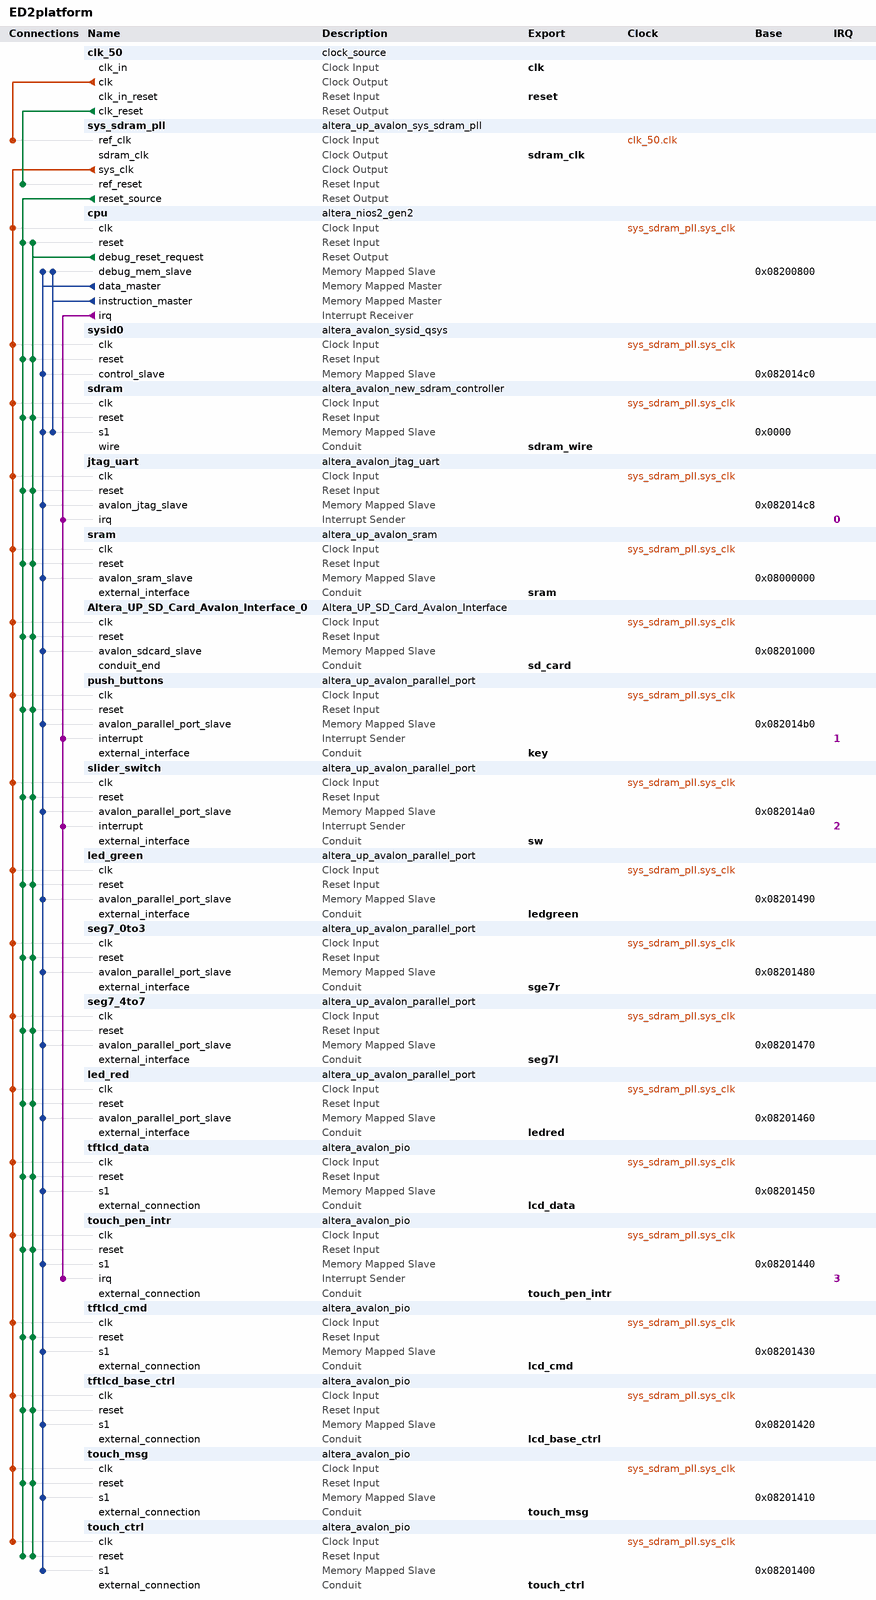
[diagram p0: system contents]
# Platform Designer (Qsys) system ED2platform, Cyclone IV E EP4CE115F29C7
# Parameters at their usual value, and those the tool derives, are not listed.
package require -exact qsys 15.0
create_system ED2platform
set_project_property DEVICE_FAMILY {Cyclone IV E}
set_project_property DEVICE EP4CE115F29C7

add_instance clk_50 clock_source 15.0
set_instance_parameter_value clk_50 clockFrequency 50000000

add_instance sys_sdram_pll altera_up_avalon_sys_sdram_pll 15.0
set_instance_parameter_value sys_sdram_pll CV_boards DE1-SoC
set_instance_parameter_value sys_sdram_pll gui_outclk 50.0
set_instance_parameter_value sys_sdram_pll gui_refclk 50.0

add_instance cpu altera_nios2_gen2 15.0
set_instance_parameter_value cpu dcache_size 2048
set_instance_parameter_value cpu exceptionSlave sdram.s1
set_instance_parameter_value cpu icache_size 4096
set_instance_parameter_value cpu impl Fast
set_instance_parameter_value cpu resetSlave sdram.s1
set_instance_parameter_value cpu setting_activateTrace true

add_instance sysid0 altera_avalon_sysid_qsys 15.0
set_instance_parameter_value sysid0 id 305419896

add_instance sdram altera_avalon_new_sdram_controller 15.0
set_instance_parameter_value sdram TAC 5.5
set_instance_parameter_value sdram TRCD 20.0
set_instance_parameter_value sdram TRP 20.0
set_instance_parameter_value sdram casLatency 3
set_instance_parameter_value sdram columnWidth 10
set_instance_parameter_value sdram dataWidth 32
set_instance_parameter_value sdram generateSimulationModel true
set_instance_parameter_value sdram model single_Micron_MT48LC4M32B2_7_chip
set_instance_parameter_value sdram numberOfBanks 4
set_instance_parameter_value sdram numberOfChipSelects 1
set_instance_parameter_value sdram powerUpDelay 100.0
set_instance_parameter_value sdram refreshPeriod 15.625
set_instance_parameter_value sdram rowWidth 13

add_instance jtag_uart altera_avalon_jtag_uart 15.0
set_instance_parameter_value jtag_uart simInteractiveOptions NO_INTERACTIVE_WINDOWS

add_instance sram altera_up_avalon_sram 15.0
set_instance_parameter_value sram board DE2-115
set_instance_parameter_value sram pixel_buffer false

add_instance Altera_UP_SD_Card_Avalon_Interface_0 Altera_UP_SD_Card_Avalon_Interface 15.0

add_instance push_buttons altera_up_avalon_parallel_port 15.0
set_instance_parameter_value push_buttons board DE2-115
set_instance_parameter_value push_buttons capture true
set_instance_parameter_value push_buttons edge Either
set_instance_parameter_value push_buttons irq true
set_instance_parameter_value push_buttons preset Pushbuttons

add_instance slider_switch altera_up_avalon_parallel_port 15.0
set_instance_parameter_value slider_switch board DE2-115
set_instance_parameter_value slider_switch capture true
set_instance_parameter_value slider_switch edge Either
set_instance_parameter_value slider_switch irq true
set_instance_parameter_value slider_switch preset {Slider Switches}

add_instance led_green altera_up_avalon_parallel_port 15.0
set_instance_parameter_value led_green board DE2-115
set_instance_parameter_value led_green capture false
set_instance_parameter_value led_green edge Rising
set_instance_parameter_value led_green irq false
set_instance_parameter_value led_green preset LEDs

add_instance seg7_0to3 altera_up_avalon_parallel_port 15.0
set_instance_parameter_value seg7_0to3 board DE2-115
set_instance_parameter_value seg7_0to3 capture false
set_instance_parameter_value seg7_0to3 edge Rising
set_instance_parameter_value seg7_0to3 irq false
set_instance_parameter_value seg7_0to3 preset {Seven Segment Displays}

add_instance seg7_4to7 altera_up_avalon_parallel_port 15.0
set_instance_parameter_value seg7_4to7 board DE2-115
set_instance_parameter_value seg7_4to7 capture false
set_instance_parameter_value seg7_4to7 edge Rising
set_instance_parameter_value seg7_4to7 irq false
set_instance_parameter_value seg7_4to7 preset {Seven Segment Displays}
set_instance_parameter_value seg7_4to7 sevensegs {7 to 4}

add_instance led_red altera_up_avalon_parallel_port 15.0
set_instance_parameter_value led_red board DE2-115
set_instance_parameter_value led_red capture false
set_instance_parameter_value led_red edge Rising
set_instance_parameter_value led_red irq false
set_instance_parameter_value led_red leds Red
set_instance_parameter_value led_red preset LEDs

add_instance tftlcd_data altera_avalon_pio 15.0
set_instance_parameter_value tftlcd_data direction Bidir
set_instance_parameter_value tftlcd_data width 16

add_instance touch_pen_intr altera_avalon_pio 15.0
set_instance_parameter_value touch_pen_intr captureEdge true
set_instance_parameter_value touch_pen_intr direction Input
set_instance_parameter_value touch_pen_intr edgeType ANY
set_instance_parameter_value touch_pen_intr generateIRQ true
set_instance_parameter_value touch_pen_intr width 1

add_instance tftlcd_cmd altera_avalon_pio 15.0
set_instance_parameter_value tftlcd_cmd direction Output
set_instance_parameter_value tftlcd_cmd width 3

add_instance tftlcd_base_ctrl altera_avalon_pio 15.0
set_instance_parameter_value tftlcd_base_ctrl direction Output
set_instance_parameter_value tftlcd_base_ctrl width 3

add_instance touch_msg altera_avalon_pio 15.0
set_instance_parameter_value touch_msg direction Input
set_instance_parameter_value touch_msg width 2

add_instance touch_ctrl altera_avalon_pio 15.0
set_instance_parameter_value touch_ctrl direction Output
set_instance_parameter_value touch_ctrl width 3

# connections
add_connection clk_50.clk sys_sdram_pll.ref_clk clock
add_connection sys_sdram_pll.sys_clk Altera_UP_SD_Card_Avalon_Interface_0.clk clock
add_connection sys_sdram_pll.sys_clk cpu.clk clock
add_connection sys_sdram_pll.sys_clk jtag_uart.clk clock
add_connection sys_sdram_pll.sys_clk led_green.clk clock
add_connection sys_sdram_pll.sys_clk led_red.clk clock
add_connection sys_sdram_pll.sys_clk push_buttons.clk clock
add_connection sys_sdram_pll.sys_clk sdram.clk clock
add_connection sys_sdram_pll.sys_clk seg7_0to3.clk clock
add_connection sys_sdram_pll.sys_clk seg7_4to7.clk clock
add_connection sys_sdram_pll.sys_clk slider_switch.clk clock
add_connection sys_sdram_pll.sys_clk sram.clk clock
add_connection sys_sdram_pll.sys_clk sysid0.clk clock
add_connection sys_sdram_pll.sys_clk tftlcd_base_ctrl.clk clock
add_connection sys_sdram_pll.sys_clk tftlcd_cmd.clk clock
add_connection sys_sdram_pll.sys_clk tftlcd_data.clk clock
add_connection sys_sdram_pll.sys_clk touch_ctrl.clk clock
add_connection sys_sdram_pll.sys_clk touch_msg.clk clock
add_connection sys_sdram_pll.sys_clk touch_pen_intr.clk clock
add_connection clk_50.clk_reset sys_sdram_pll.ref_reset reset
add_connection cpu.debug_reset_request Altera_UP_SD_Card_Avalon_Interface_0.reset reset
add_connection cpu.debug_reset_request cpu.reset reset
add_connection cpu.debug_reset_request jtag_uart.reset reset
add_connection cpu.debug_reset_request led_green.reset reset
add_connection cpu.debug_reset_request led_red.reset reset
add_connection cpu.debug_reset_request push_buttons.reset reset
add_connection cpu.debug_reset_request sdram.reset reset
add_connection cpu.debug_reset_request seg7_0to3.reset reset
add_connection cpu.debug_reset_request seg7_4to7.reset reset
add_connection cpu.debug_reset_request slider_switch.reset reset
add_connection cpu.debug_reset_request sram.reset reset
add_connection cpu.debug_reset_request sysid0.reset reset
add_connection cpu.debug_reset_request tftlcd_base_ctrl.reset reset
add_connection cpu.debug_reset_request tftlcd_cmd.reset reset
add_connection cpu.debug_reset_request tftlcd_data.reset reset
add_connection cpu.debug_reset_request touch_ctrl.reset reset
add_connection cpu.debug_reset_request touch_msg.reset reset
add_connection cpu.debug_reset_request touch_pen_intr.reset reset
add_connection sys_sdram_pll.reset_source Altera_UP_SD_Card_Avalon_Interface_0.reset reset
add_connection sys_sdram_pll.reset_source cpu.reset reset
add_connection sys_sdram_pll.reset_source jtag_uart.reset reset
add_connection sys_sdram_pll.reset_source led_green.reset reset
add_connection sys_sdram_pll.reset_source led_red.reset reset
add_connection sys_sdram_pll.reset_source push_buttons.reset reset
add_connection sys_sdram_pll.reset_source sdram.reset reset
add_connection sys_sdram_pll.reset_source seg7_0to3.reset reset
add_connection sys_sdram_pll.reset_source seg7_4to7.reset reset
add_connection sys_sdram_pll.reset_source slider_switch.reset reset
add_connection sys_sdram_pll.reset_source sram.reset reset
add_connection sys_sdram_pll.reset_source sysid0.reset reset
add_connection sys_sdram_pll.reset_source tftlcd_base_ctrl.reset reset
add_connection sys_sdram_pll.reset_source tftlcd_cmd.reset reset
add_connection sys_sdram_pll.reset_source tftlcd_data.reset reset
add_connection sys_sdram_pll.reset_source touch_ctrl.reset reset
add_connection sys_sdram_pll.reset_source touch_msg.reset reset
add_connection sys_sdram_pll.reset_source touch_pen_intr.reset reset
add_connection cpu.data_master Altera_UP_SD_Card_Avalon_Interface_0.avalon_sdcard_slave avalon
set_connection_parameter_value cpu.data_master/Altera_UP_SD_Card_Avalon_Interface_0.avalon_sdcard_slave baseAddress 0x08201000
add_connection cpu.data_master cpu.debug_mem_slave avalon
set_connection_parameter_value cpu.data_master/cpu.debug_mem_slave baseAddress 0x08200800
add_connection cpu.data_master jtag_uart.avalon_jtag_slave avalon
set_connection_parameter_value cpu.data_master/jtag_uart.avalon_jtag_slave baseAddress 0x082014c8
add_connection cpu.data_master led_green.avalon_parallel_port_slave avalon
set_connection_parameter_value cpu.data_master/led_green.avalon_parallel_port_slave baseAddress 0x08201490
add_connection cpu.data_master led_red.avalon_parallel_port_slave avalon
set_connection_parameter_value cpu.data_master/led_red.avalon_parallel_port_slave baseAddress 0x08201460
add_connection cpu.data_master push_buttons.avalon_parallel_port_slave avalon
set_connection_parameter_value cpu.data_master/push_buttons.avalon_parallel_port_slave baseAddress 0x082014b0
add_connection cpu.data_master sdram.s1 avalon
set_connection_parameter_value cpu.data_master/sdram.s1 baseAddress 0x0000
add_connection cpu.data_master seg7_0to3.avalon_parallel_port_slave avalon
set_connection_parameter_value cpu.data_master/seg7_0to3.avalon_parallel_port_slave baseAddress 0x08201480
add_connection cpu.data_master seg7_4to7.avalon_parallel_port_slave avalon
set_connection_parameter_value cpu.data_master/seg7_4to7.avalon_parallel_port_slave baseAddress 0x08201470
add_connection cpu.data_master slider_switch.avalon_parallel_port_slave avalon
set_connection_parameter_value cpu.data_master/slider_switch.avalon_parallel_port_slave baseAddress 0x082014a0
add_connection cpu.data_master sram.avalon_sram_slave avalon
set_connection_parameter_value cpu.data_master/sram.avalon_sram_slave baseAddress 0x08000000
add_connection cpu.data_master sysid0.control_slave avalon
set_connection_parameter_value cpu.data_master/sysid0.control_slave baseAddress 0x082014c0
add_connection cpu.data_master tftlcd_base_ctrl.s1 avalon
set_connection_parameter_value cpu.data_master/tftlcd_base_ctrl.s1 baseAddress 0x08201420
add_connection cpu.data_master tftlcd_cmd.s1 avalon
set_connection_parameter_value cpu.data_master/tftlcd_cmd.s1 baseAddress 0x08201430
add_connection cpu.data_master tftlcd_data.s1 avalon
set_connection_parameter_value cpu.data_master/tftlcd_data.s1 baseAddress 0x08201450
add_connection cpu.data_master touch_ctrl.s1 avalon
set_connection_parameter_value cpu.data_master/touch_ctrl.s1 baseAddress 0x08201400
add_connection cpu.data_master touch_msg.s1 avalon
set_connection_parameter_value cpu.data_master/touch_msg.s1 baseAddress 0x08201410
add_connection cpu.data_master touch_pen_intr.s1 avalon
set_connection_parameter_value cpu.data_master/touch_pen_intr.s1 baseAddress 0x08201440
add_connection cpu.instruction_master cpu.debug_mem_slave avalon
set_connection_parameter_value cpu.instruction_master/cpu.debug_mem_slave baseAddress 0x08200800
add_connection cpu.instruction_master sdram.s1 avalon
set_connection_parameter_value cpu.instruction_master/sdram.s1 baseAddress 0x0000
add_connection cpu.irq jtag_uart.irq interrupt
set_connection_parameter_value cpu.irq/jtag_uart.irq irqNumber 0
add_connection cpu.irq push_buttons.interrupt interrupt
set_connection_parameter_value cpu.irq/push_buttons.interrupt irqNumber 1
add_connection cpu.irq slider_switch.interrupt interrupt
set_connection_parameter_value cpu.irq/slider_switch.interrupt irqNumber 2
add_connection cpu.irq touch_pen_intr.irq interrupt
set_connection_parameter_value cpu.irq/touch_pen_intr.irq irqNumber 3

# exported interfaces
add_interface clk clock sink
set_interface_property clk EXPORT_OF clk_50.clk_in
add_interface key conduit end
set_interface_property key EXPORT_OF push_buttons.external_interface
add_interface lcd_base_ctrl conduit end
set_interface_property lcd_base_ctrl EXPORT_OF tftlcd_base_ctrl.external_connection
add_interface lcd_cmd conduit end
set_interface_property lcd_cmd EXPORT_OF tftlcd_cmd.external_connection
add_interface lcd_data conduit end
set_interface_property lcd_data EXPORT_OF tftlcd_data.external_connection
add_interface ledgreen conduit end
set_interface_property ledgreen EXPORT_OF led_green.external_interface
add_interface ledred conduit end
set_interface_property ledred EXPORT_OF led_red.external_interface
add_interface reset reset sink
set_interface_property reset EXPORT_OF clk_50.clk_in_reset
add_interface sd_card conduit end
set_interface_property sd_card EXPORT_OF Altera_UP_SD_Card_Avalon_Interface_0.conduit_end
add_interface sdram_clk clock source
set_interface_property sdram_clk EXPORT_OF sys_sdram_pll.sdram_clk
add_interface sdram_wire conduit end
set_interface_property sdram_wire EXPORT_OF sdram.wire
add_interface seg7l conduit end
set_interface_property seg7l EXPORT_OF seg7_4to7.external_interface
add_interface sge7r conduit end
set_interface_property sge7r EXPORT_OF seg7_0to3.external_interface
add_interface sram conduit end
set_interface_property sram EXPORT_OF sram.external_interface
add_interface sw conduit end
set_interface_property sw EXPORT_OF slider_switch.external_interface
add_interface touch_ctrl conduit end
set_interface_property touch_ctrl EXPORT_OF touch_ctrl.external_connection
add_interface touch_msg conduit end
set_interface_property touch_msg EXPORT_OF touch_msg.external_connection
add_interface touch_pen_intr conduit end
set_interface_property touch_pen_intr EXPORT_OF touch_pen_intr.external_connection

set_interconnect_requirement {$system} qsys_mm.clockCrossingAdapter HANDSHAKE
set_interconnect_requirement {$system} qsys_mm.enableEccProtection FALSE
set_interconnect_requirement {$system} qsys_mm.insertDefaultSlave FALSE
set_interconnect_requirement {$system} qsys_mm.maxAdditionalLatency 1

save_system ED2platform.qsys
